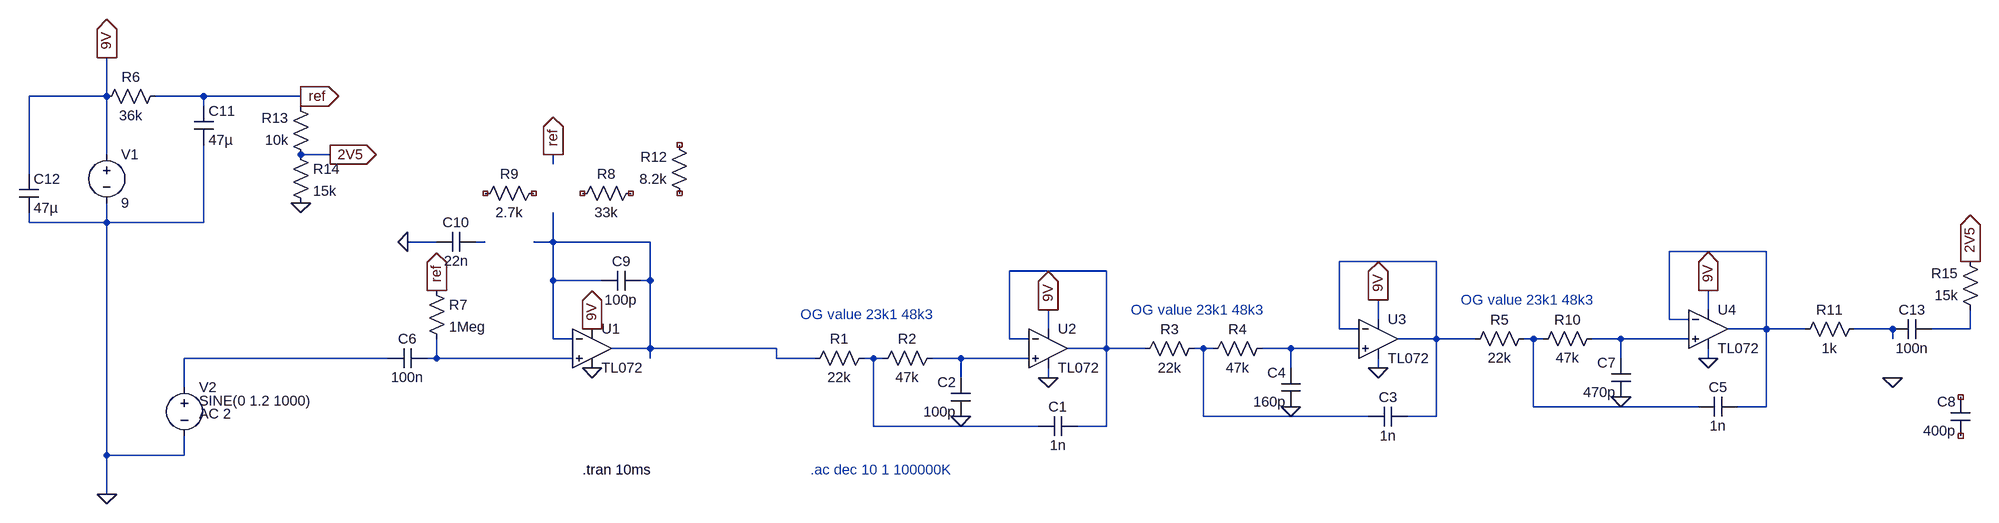
[diagram p0: schematic Butterworth_input_filter_v3.asc]
Butterworth_input_filter_v3.asc, the LTspice schematic file:
Version 4
SHEET 1 2072 680
WIRE -1104 -96 -1104 -160
WIRE -1104 -96 -1232 -96
WIRE -944 -96 -1024 -96
WIRE -784 -96 -944 -96
WIRE -944 -80 -944 -96
WIRE -784 -80 -784 -96
WIRE -1104 0 -1104 -96
WIRE -736 0 -784 0
WIRE -368 16 -368 0
WIRE -1232 32 -1232 -96
WIRE -1232 112 -1232 96
WIRE -1104 112 -1104 80
WIRE -1104 112 -1232 112
WIRE -944 112 -944 -16
WIRE -944 112 -1104 112
WIRE -560 144 -608 144
WIRE -480 144 -496 144
WIRE -368 144 -368 96
WIRE -368 144 -400 144
WIRE -208 144 -368 144
WIRE 1632 160 1472 160
WIRE 1088 176 928 176
WIRE 544 192 384 192
WIRE -368 208 -368 144
WIRE -288 208 -368 208
WIRE -208 208 -208 144
WIRE -208 208 -224 208
WIRE 1536 256 1536 224
WIRE 992 272 992 240
WIRE 1472 272 1472 160
WIRE 1504 272 1472 272
WIRE 448 288 448 256
WIRE 928 288 928 176
WIRE 960 288 928 288
WIRE 1632 288 1632 160
WIRE 1632 288 1568 288
WIRE 1696 288 1632 288
WIRE 1840 288 1776 288
WIRE 1968 288 1968 256
WIRE 1968 288 1904 288
WIRE -368 304 -368 208
WIRE -336 304 -368 304
WIRE 384 304 384 192
WIRE 416 304 384 304
WIRE 1088 304 1088 176
WIRE 1088 304 1024 304
WIRE 1152 304 1088 304
WIRE 1248 304 1232 304
WIRE 1264 304 1248 304
WIRE 1392 304 1344 304
WIRE 1504 304 1392 304
WIRE 1840 304 1840 288
WIRE -208 320 -208 208
WIRE -208 320 -272 320
WIRE 0 320 -208 320
WIRE 544 320 544 192
WIRE 544 320 480 320
WIRE 608 320 544 320
WIRE 704 320 688 320
WIRE 720 320 704 320
WIRE 848 320 800 320
WIRE 960 320 848 320
WIRE -640 336 -976 336
WIRE -560 336 -560 304
WIRE -560 336 -576 336
WIRE -336 336 -560 336
WIRE -208 336 -208 320
WIRE 0 336 0 320
WIRE 64 336 0 336
WIRE 160 336 144 336
WIRE 176 336 160 336
WIRE 304 336 256 336
WIRE 416 336 304 336
WIRE 1392 336 1392 304
WIRE 1536 336 1536 320
WIRE 848 352 848 320
WIRE 992 352 992 336
WIRE 304 368 304 336
WIRE 448 368 448 352
WIRE -976 384 -976 336
WIRE 1248 416 1248 304
WIRE 1520 416 1248 416
WIRE 1632 416 1632 288
WIRE 1632 416 1584 416
WIRE 704 432 704 320
WIRE 976 432 704 432
WIRE 1088 432 1088 304
WIRE 1088 432 1040 432
WIRE 160 448 160 336
WIRE 432 448 160 448
WIRE 544 448 544 320
WIRE 544 448 496 448
WIRE -1104 496 -1104 112
WIRE -976 496 -976 464
WIRE -976 496 -1104 496
WIRE -1104 560 -1104 496
FLAG 448 368 0
FLAG -1104 560 0
FLAG -1104 -160 9V
IOPIN -1104 -160 Out
FLAG 448 256 9V
IOPIN 448 256 Out
FLAG 304 432 0
FLAG 992 352 0
FLAG 992 240 9V
IOPIN 992 240 Out
FLAG 848 416 0
FLAG -784 -96 ref
IOPIN -784 -96 Out
FLAG -560 224 ref
IOPIN -560 224 Out
FLAG -304 288 9V
IOPIN -304 288 Out
FLAG -304 352 0
FLAG -608 144 0
FLAG 1536 336 0
FLAG 1536 224 9V
IOPIN 1536 224 Out
FLAG 1392 400 0
FLAG 1840 368 0
FLAG -368 0 ref
IOPIN -368 0 Out
FLAG -784 80 0
FLAG -736 0 2V5
IOPIN -736 0 Out
FLAG 1968 176 2V5
IOPIN 1968 176 Out
SYMBOL voltage -1104 -16 R0
WINDOW 123 0 0 Left 0
WINDOW 39 0 0 Left 0
SYMATTR InstName V1
SYMATTR Value 9
SYMBOL voltage -976 368 R0
WINDOW 3 24 38 Left 2
WINDOW 123 24 60 Left 2
WINDOW 39 0 0 Left 0
SYMATTR Value SINE(0 1.2 1000)
SYMATTR Value2 AC 2
SYMATTR InstName V2
SYMBOL res 160 320 R90
WINDOW 0 0 56 VBottom 2
WINDOW 3 32 56 VTop 2
SYMATTR InstName R1
SYMATTR Value 22k
SYMBOL res 272 320 R90
WINDOW 0 0 56 VBottom 2
WINDOW 3 32 56 VTop 2
SYMATTR InstName R2
SYMATTR Value 47k
SYMBOL cap 496 432 R90
WINDOW 0 0 32 VBottom 2
WINDOW 3 32 32 VTop 2
SYMATTR InstName C1
SYMATTR Value 1n
SYMBOL cap 320 432 R180
WINDOW 0 24 56 Left 2
WINDOW 3 24 8 Left 2
SYMATTR InstName C2
SYMATTR Value 100p
SYMBOL res 704 304 R90
WINDOW 0 0 56 VBottom 2
WINDOW 3 32 56 VTop 2
SYMATTR InstName R3
SYMATTR Value 22k
SYMBOL res 816 304 R90
WINDOW 0 0 56 VBottom 2
WINDOW 3 32 56 VTop 2
SYMATTR InstName R4
SYMATTR Value 47k
SYMBOL cap 1040 416 R90
WINDOW 0 0 32 VBottom 2
WINDOW 3 32 32 VTop 2
SYMATTR InstName C3
SYMATTR Value 1n
SYMBOL cap 864 416 R180
WINDOW 0 24 56 Left 2
WINDOW 3 24 8 Left 2
SYMATTR InstName C4
SYMATTR Value 160p
SYMBOL cap -576 320 R90
WINDOW 0 0 32 VBottom 2
WINDOW 3 32 32 VTop 2
SYMATTR InstName C6
SYMATTR Value 100n
SYMBOL res -576 208 R0
SYMATTR InstName R7
SYMATTR Value 1Meg
SYMBOL res -224 48 R90
WINDOW 0 0 56 VBottom 2
WINDOW 3 32 56 VTop 2
SYMATTR InstName R8
SYMATTR Value 33k
SYMBOL res -384 48 R90
WINDOW 0 0 56 VBottom 2
WINDOW 3 32 56 VTop 2
SYMATTR InstName R9
SYMATTR Value 2.7k
SYMBOL TL072 -304 256 R0
SYMATTR InstName U1
SYMBOL TL072 448 256 R0
SYMATTR InstName U2
SYMBOL TL072 992 240 R0
SYMATTR InstName U3
SYMBOL res 1248 288 R90
WINDOW 0 0 56 VBottom 2
WINDOW 3 32 56 VTop 2
SYMATTR InstName R5
SYMATTR Value 22k
SYMBOL res 1360 288 R90
WINDOW 0 0 56 VBottom 2
WINDOW 3 32 56 VTop 2
SYMATTR InstName R10
SYMATTR Value 47k
SYMBOL cap 1584 400 R90
WINDOW 0 0 32 VBottom 2
WINDOW 3 32 32 VTop 2
SYMATTR InstName C5
SYMATTR Value 1n
SYMBOL cap 1408 400 R180
WINDOW 0 24 56 Left 2
WINDOW 3 24 8 Left 2
SYMATTR InstName C7
SYMATTR Value 470p
SYMBOL TL072 1536 224 R0
SYMATTR InstName U4
SYMBOL cap 1968 464 R180
WINDOW 0 24 56 Left 2
WINDOW 3 24 8 Left 2
SYMATTR InstName C8
SYMATTR Value 400p
SYMBOL res 1792 272 R90
WINDOW 0 0 56 VBottom 2
WINDOW 3 32 56 VTop 2
SYMATTR InstName R11
SYMATTR Value 1k
SYMBOL res -144 80 R180
WINDOW 0 36 76 Left 2
WINDOW 3 36 40 Left 2
SYMATTR InstName R12
SYMATTR Value 8.2k
SYMBOL cap -288 224 R270
WINDOW 0 32 32 VTop 2
WINDOW 3 0 32 VBottom 2
SYMATTR InstName C9
SYMATTR Value 100p
SYMBOL res -1008 -112 R90
WINDOW 0 0 56 VBottom 2
WINDOW 3 32 56 VTop 2
SYMATTR InstName R6
SYMATTR Value 36k
SYMBOL res -768 16 R180
WINDOW 0 36 76 Left 2
WINDOW 3 36 40 Left 2
SYMATTR InstName R13
SYMATTR Value 10k
SYMBOL res -800 -16 R0
SYMATTR InstName R14
SYMATTR Value 15k
SYMBOL cap -496 128 R90
WINDOW 0 0 32 VBottom 2
WINDOW 3 32 32 VTop 2
SYMATTR InstName C10
SYMATTR Value 22n
SYMBOL cap -960 -80 R0
SYMATTR InstName C11
SYMATTR Value 47µ
SYMBOL cap -1248 32 R0
SYMATTR InstName C12
SYMATTR Value 47µ
SYMBOL cap 1904 272 R90
WINDOW 0 0 32 VBottom 2
WINDOW 3 32 32 VTop 2
SYMATTR InstName C13
SYMATTR Value 100n
SYMBOL res 1984 272 R180
WINDOW 0 36 76 Left 2
WINDOW 3 36 40 Left 2
SYMATTR InstName R15
SYMATTR Value 15k
TEXT 56 520 Left 2 ;.ac dec 10 1 100000K
TEXT 40 264 Left 2 ;OG value 23k1 48k3
TEXT 584 256 Left 2 ;OG value 23k1 48k3
TEXT -320 520 Left 2 !.tran 10ms
TEXT 1128 240 Left 2 ;OG value 23k1 48k3

The netlist it stands for:
* Butterworth_input_filter_v3.asc
V1 9V 0 9
V2 N012 0 SINE(0 1.2 1000) AC 2
R1 N014 N002 22k
R2 N015 N014 47k
C1 N005 N014 1n
C2 0 N015 100p
R3 N010 N005 22k
R4 N011 N010 47k
C3 N004 N010 1n
C4 0 N011 160p
C6 N013 N012 100n
R7 ref N013 1Meg
R8 NC_01 NC_02 33k
R9 NC_03 NC_04 2.7k
* U1: TL072 (symbol TL072 not available, pins judged from their places): In+=N013 In-=N002 V+=9V V-=0 OUT=N002
* U2: TL072 (symbol TL072 not available, pins judged from their places): In+=N015 In-=N005 V+=9V V-=0 OUT=N005
* U3: TL072 (symbol TL072 not available, pins judged from their places): In+=N011 In-=N004 V+=9V V-=0 OUT=N004
R5 N008 N004 22k
R10 N009 N008 47k
C5 N003 N008 1n
C7 0 N009 470p
* U4: TL072 (symbol TL072 not available, pins judged from their places): In+=N009 In-=N003 V+=9V V-=0 OUT=N003
C8 NC_05 NC_06 400p
R11 N006 N003 1k
R12 NC_07 NC_08 8.2k
C9 N002 N002 100p
R6 ref 9V 36k
R13 2V5 ref 10k
R14 2V5 0 15k
C10 N001 0 22n
C11 ref 0 47µ
C12 9V 0 47µ
C13 N007 N006 100n
R15 N007 2V5 15k
* .ac dec 10 1 100000K
* OG value 23k1 48k3
* OG value 23k1 48k3
.tran 10ms
* OG value 23k1 48k3
.backanno
.end